# EAGLE design Main_Bord (EAGLE 8.5.1)
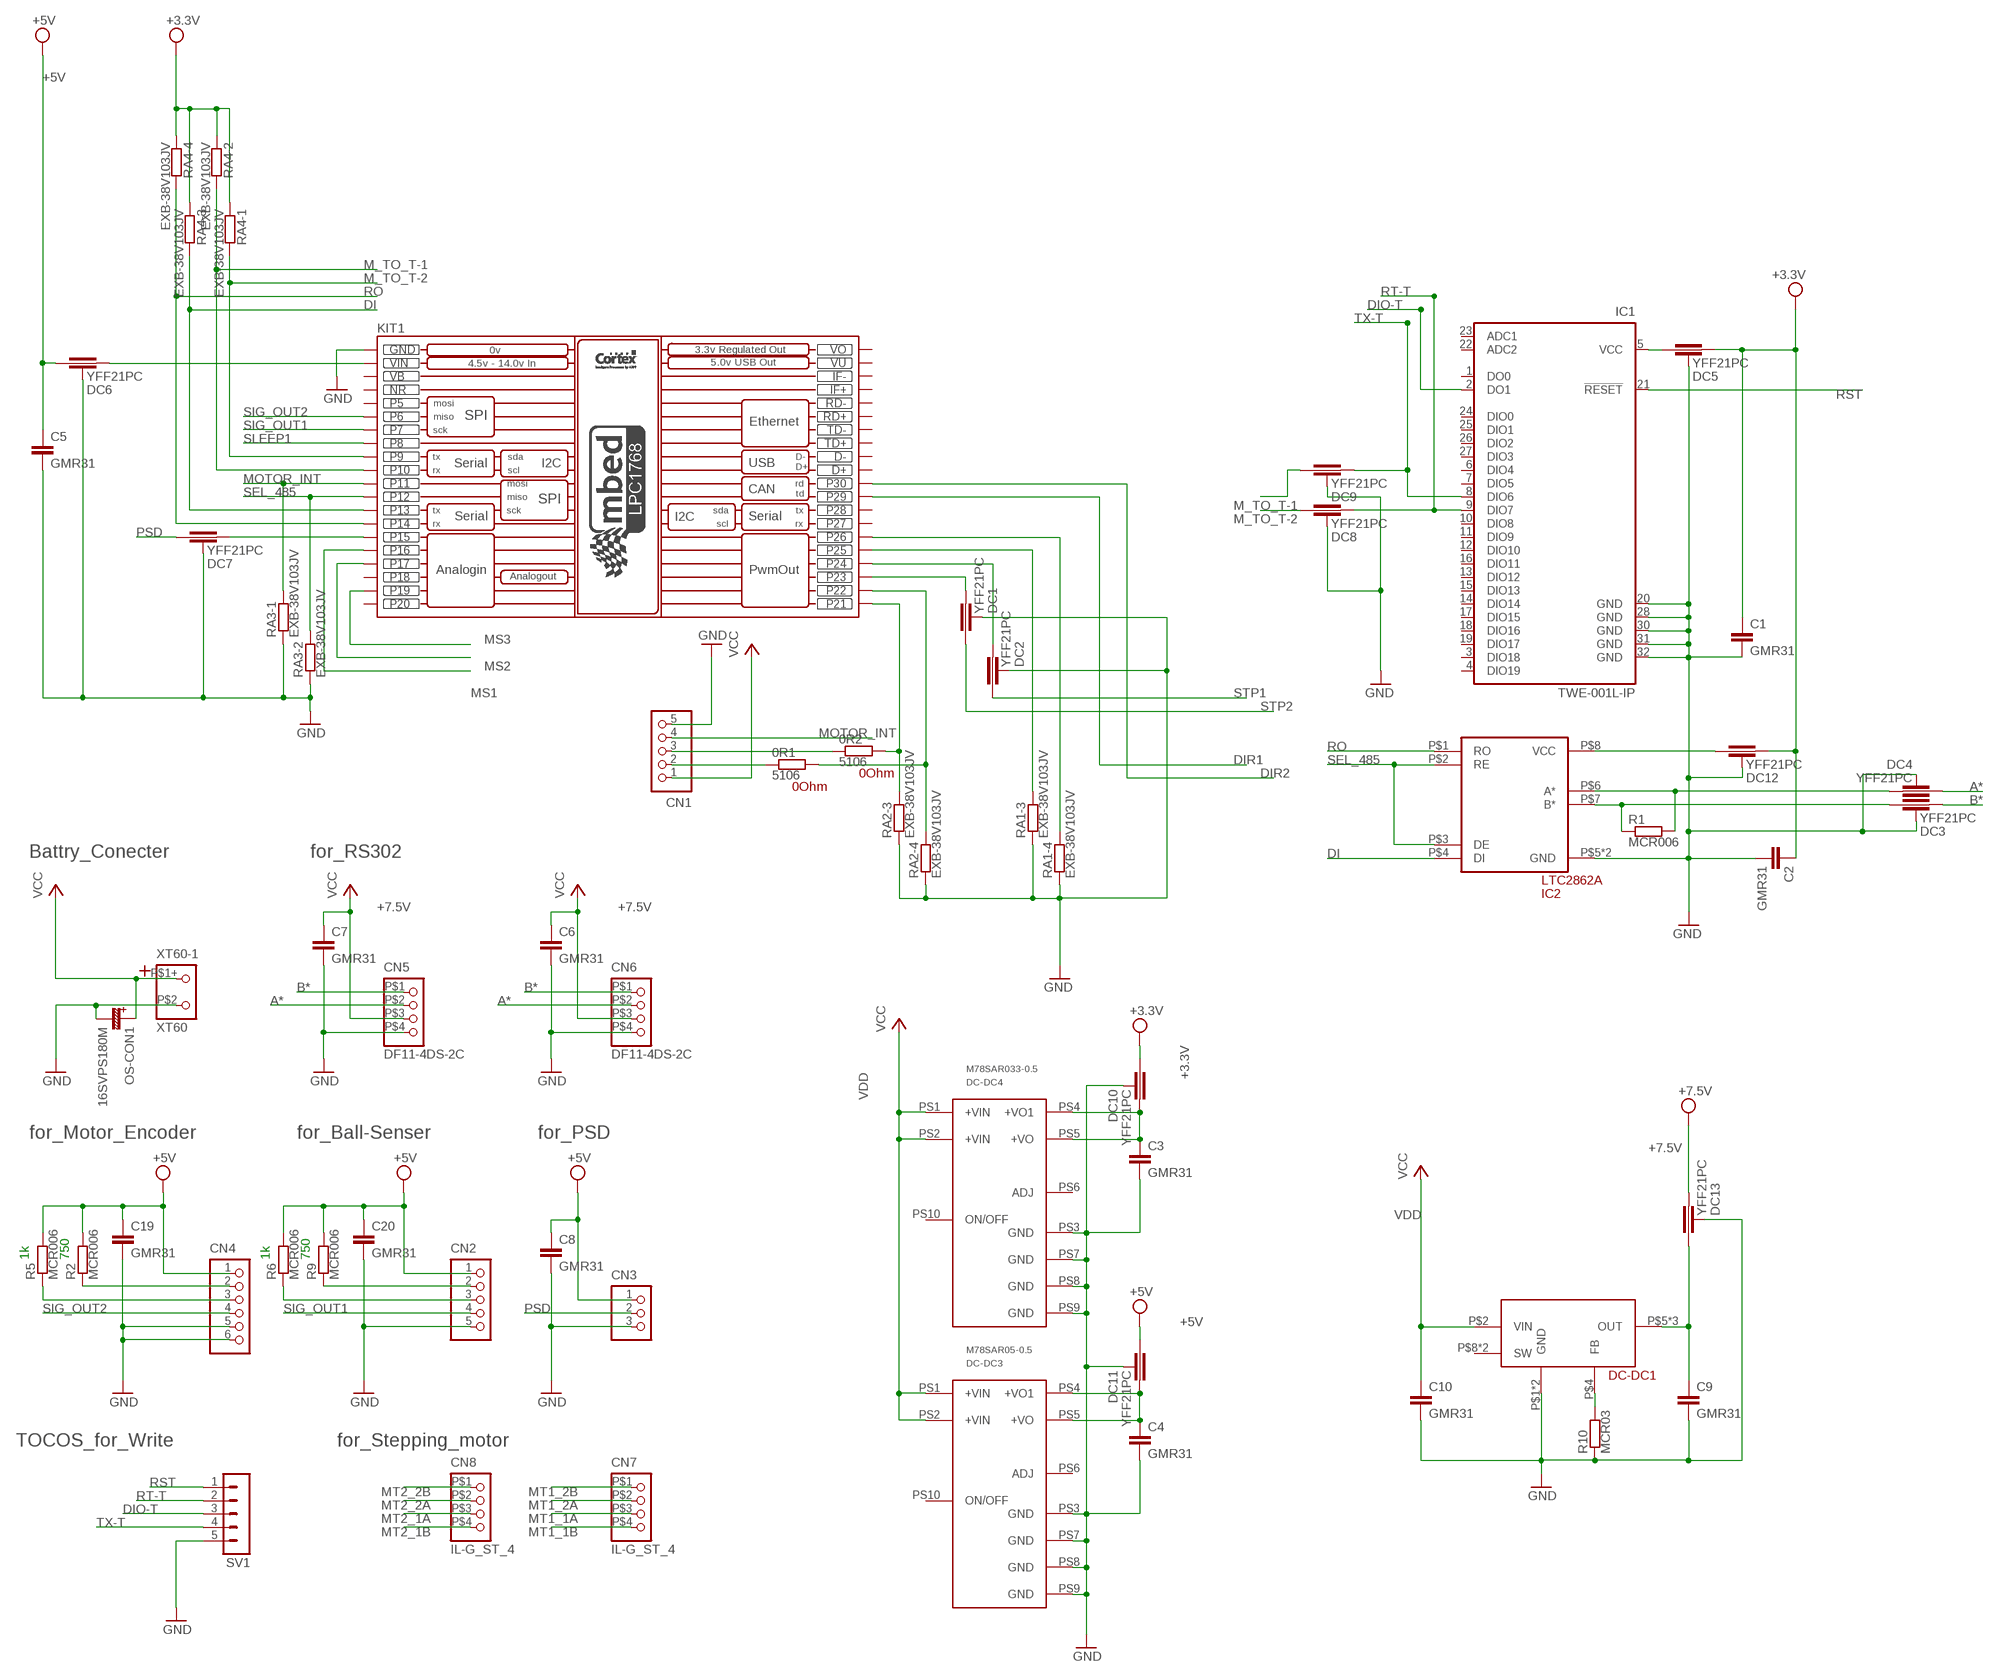
[diagram p0: schematic, sheet 1, part 1 of 2]
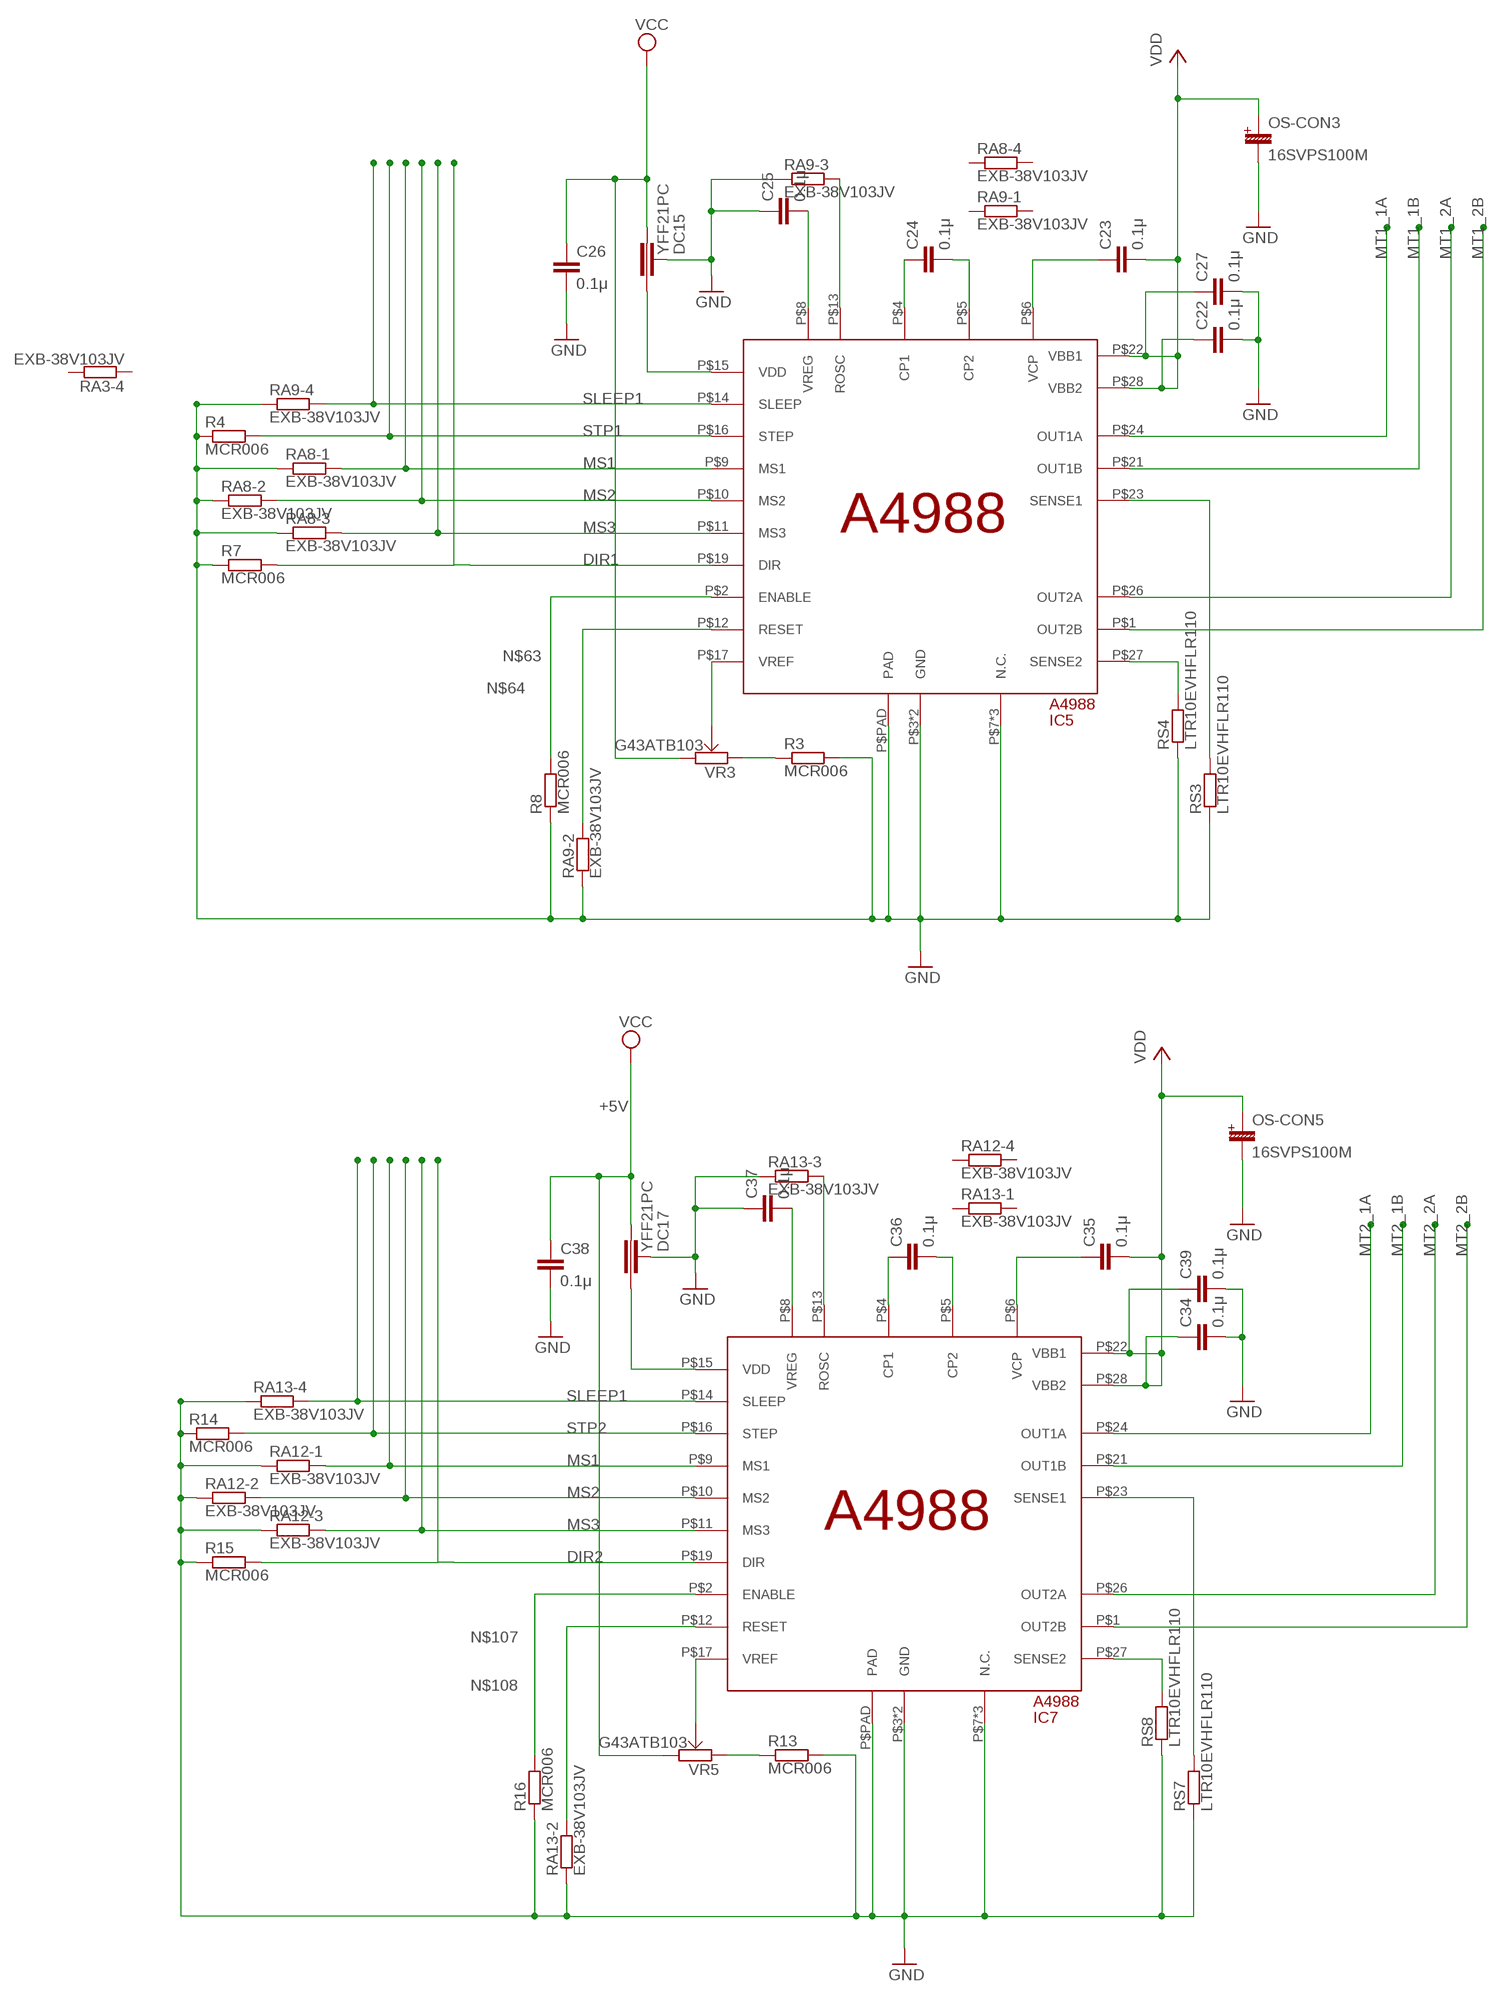
[diagram p1: schematic, sheet 1, part 2 of 2]

## Parts
0R1  5106  [5106JUMP_0805]
0R2  5106  [5106JUMP_0805]
C1  GMR31  [GMR31]
C2  GMR31  [GMR31]
C3  GMR31  [GMR31]
C4  GMR31  [GMR31]
C5  GMR31  [GMR31]
C6  GMR31  [GMR31]
C7  GMR31  [GMR31]
C8  GMR31  [GMR31]
C9  GMR31  [GMR31]
C10  GMR31  [GMR31]
C19  GMR31  [GMR31]
C20  GMR31  [GMR31]
C22  0.1μ  GRM033R61C104KE14  [GRM03]
C23  0.1μ  GRM033R61C104KE14  [GRM03]
C24  0.1μ  GRM033R61C104KE14  [GRM03]
C25  0.1μ  GRM033R61C104KE14  [GRM03]
C26  0.1μ  GRM033R61C104KE14  [GRM03]
C27  0.1μ  GRM033R61C104KE14  [GRM03]
C34  0.1μ  GRM033R61C104KE14  [GRM03]
C35  0.1μ  GRM033R61C104KE14  [GRM03]
C36  0.1μ  GRM033R61C104KE14  [GRM03]
C37  0.1μ  GRM033R61C104KE14  [GRM03]
C38  0.1μ  GRM033R61C104KE14  [GRM03]
C39  0.1μ  GRM033R61C104KE14  [GRM03]
CN1  B5B-XH-A  [B5B-XH-A]
CN2  B5B-XH-A  [B5B-XH-A]
CN3  B3B-XH-A  [B3B-XH-A]
CN4  B6B-XH-A  [B6B-XH-A]
CN5  DF11-4DS-2C  [DF11-4DS-2C]
CN6  DF11-4DS-2C  [DF11-4DS-2C]
CN7  IL-G_ST_4  [IL-G_V-4]
CN8  IL-G_ST_4  [IL-G_V-4]
DC1  YFF21PC  [YFF21PC]
DC2  YFF21PC  [YFF21PC]
DC3  YFF21PC  [YFF21PC]
DC4  YFF21PC  [YFF21PC]
DC5  YFF21PC  [YFF21PC]
DC6  YFF21PC  [YFF21PC]
DC7  YFF21PC  [YFF21PC]
DC8  YFF21PC  [YFF21PC]
DC9  YFF21PC  [YFF21PC]
DC10  YFF21PC  [YFF21PC]
DC11  YFF21PC  [YFF21PC]
DC12  YFF21PC  [YFF21PC]
DC13  YFF21PC  [YFF21PC]
DC15  YFF21PC  [YFF21PC]
DC17  YFF21PC  [YFF21PC]
DC-DC1  MPM01  [MPM00_V]
DC-DC3  M78SAR05-0.5  [M78SAR]
DC-DC4  M78SAR033-0.5  [M78SAR]
IC1  TWE-001L-IP  [QFN32]
IC2  LTC2862A  [DD_PACKGE_8]
IC5  A4988  [ET_PACKGE,28PIN_WITH_EXPAD]
IC7  A4988  [ET_PACKGE,28PIN_WITH_EXPAD]
KIT1  MBED_NXP_LPC1768  [MBED-KIT]
OS-CON1  16SVPS180M  [SVCP_F8]
OS-CON3  16SVPS100M  [SVCP_F8]
OS-CON5  16SVPS100M  [SVCP_F8]
R1  MCR006  [MCR006]
R2  MCR006  [MCR006]
R3  MCR006  [MCR006]
R4  MCR006  [MCR006]
R5  MCR006  [MCR006]
R6  MCR006  [MCR006]
R7  MCR006  [MCR006]
R8  MCR006  [MCR006]
R9  MCR006  [MCR006]
R10  MCR03  [MCR03]
R13  MCR006  [MCR006]
R14  MCR006  [MCR006]
R15  MCR006  [MCR006]
R16  MCR006  [MCR006]
RA1  EXB-38V103JV  [EXB-38V,28V]
RA2  EXB-38V103JV  [EXB-38V,28V]
RA3  EXB-38V103JV  [EXB-38V,28V]
RA4  EXB-38V103JV  [EXB-38V,28V]
RA8  EXB-38V103JV  [EXB-38V,28V]
RA9  EXB-38V103JV  [EXB-38V,28V]
RA12  EXB-38V103JV  [EXB-38V,28V]
RA13  EXB-38V103JV  [EXB-38V,28V]
RS3  LTR10EVHFLR110  [LTR10]
RS4  LTR10EVHFLR110  [LTR10]
RS7  LTR10EVHFLR110  [LTR10]
RS8  LTR10EVHFLR110  [LTR10]
SV1  MA05-1  [MA05-1]
VR3  G43ATB103  [G43A]
VR5  G43ATB103  [G43A]
XT60-1  XT60  [XT60]

## Nets
+3.3V: C1.P$1 C2.P$1 DC5.P$2 DC10.P$1 DC12.P$2 RA4.P$5 RA4.P$6 RA4.P$7 RA4.P$8
+5V: C5.P$1 C8.P$1 C19.P$1 C20.P$1 C26.P$1 C38.P$1 CN2.1 CN3.1 CN4.1 DC6.P$1 DC11.P$1 DC15.P$2 DC17.P$2 R2.P$1 R5.P$1 R6.P$1 R9.P$1 VR3.P$2 VR5.P$2 ; supply symbol labelled VCC
+7.5V: C6.P$1 C7.P$1 CN5.P$3 CN6.P$3 DC13.P$2 ; supply symbol labelled VCC
A*: CN5.P$2 CN6.P$2 DC4.P$1
B*: CN5.P$1 CN6.P$1 DC3.P$2
DI: IC2.P$4(DI) KIT1.P$13(P13) RA4.P$3
DIO-T: IC1.2(DO1) SV1.3
DIR1: IC5.P$19(DIR) KIT1.P$29(P29) R7.P$1
DIR2: IC7.P$19(DIR) KIT1.P$30(P30) R15.P$1
DIR5: IC5.P$23(SENSE1) RS3.P$1
DIR7: IC7.P$23(SENSE1) RS7.P$1
GND: C1.P$2 C2.P$2 C3.P$2 C4.P$2 C5.P$2 C6.P$2 C7.P$2 C8.P$2 C9.P$2 C10.P$2 C19.P$2 C20.P$2 C22.P$2 C25.P$1 C26.P$2 C27.P$2 C34.P$2 C37.P$1 C38.P$2 C39.P$2 CN1.5 CN2.5 CN3.3 CN4.5 CN4.6 CN5.P$4 CN6.P$4 DC1.GND1(GND) DC1.GND2(GND) DC2.GND1(GND) DC2.GND2(GND) DC3.GND1(GND) DC3.GND2(GND) DC4.GND1(GND) DC4.GND2(GND) DC5.GND1(GND) DC5.GND2(GND) DC6.GND1(GND) DC6.GND2(GND) DC7.GND1(GND) DC7.GND2(GND) DC8.GND1(GND) DC8.GND2(GND) DC9.GND1(GND) DC9.GND2(GND) DC10.GND1(GND) DC10.GND2(GND) DC11.GND1(GND) DC11.GND2(GND) DC12.GND1(GND) DC12.GND2(GND) DC13.GND1(GND) DC13.GND2(GND) DC15.GND1(GND) DC15.GND2(GND) DC17.GND1(GND) DC17.GND2(GND) DC-DC1.P$1(GND) DC-DC1.P$3(GND) DC-DC3.PS3(GND) DC-DC3.PS7(GND) DC-DC3.PS8(GND) DC-DC3.PS9(GND) DC-DC4.PS3(GND) DC-DC4.PS7(GND) DC-DC4.PS8(GND) DC-DC4.PS9(GND) IC1.20(GND) IC1.28(GND) IC1.30(GND) IC1.31(GND) IC1.32(GND) IC2.P$5(GND) IC2.PAD(GND) IC5.P$3(GND) IC5.P$7(N.C.) IC5.P$18(GND) IC5.P$20(N.C.) IC5.P$25(N.C.) IC5.P$PAD(PAD) IC7.P$3(GND) IC7.P$7(N.C.) IC7.P$18(GND) IC7.P$20(N.C.) IC7.P$25(N.C.) IC7.P$PAD(PAD) KIT1.GND OS-CON1.P$1 OS-CON3.P$1 OS-CON5.P$1 R3.P$1 R4.P$2 R7.P$2 R8.P$2 R10.P$2 R13.P$1 R14.P$2 R15.P$2 R16.P$2 RA1.P$5 RA1.P$6 RA2.P$5 RA2.P$6 RA3.P$7 RA3.P$8 RA8.P$6 RA8.P$7 RA8.P$8 RA9.P$5 RA9.P$6 RA9.P$7 RA12.P$6 RA12.P$7 RA12.P$8 RA13.P$5 RA13.P$6 RA13.P$7 RS3.P$2 RS4.P$2 RS7.P$2 RS8.P$2 SV1.5 XT60-1.P$2
M_TO_T-1: DC9.P$1 KIT1.P$10(P10) RA4.P$2
M_TO_T-2: DC8.P$1 KIT1.P$9(P9) RA4.P$1
MOTOR_INT: CN1.4 KIT1.P$11(P11) RA3.P$1
MS1: IC5.P$9(MS1) IC7.P$9(MS1) KIT1.P$16(P16) RA8.P$1 RA12.P$1
MS2: IC5.P$10(MS2) IC7.P$10(MS2) KIT1.P$17(P17) RA8.P$2 RA12.P$2
MS3: IC5.P$11(MS3) IC7.P$11(MS3) KIT1.P$19(P19) RA8.P$3 RA12.P$3
MT1_1A: CN7.P$3 IC5.P$24(OUT1A)
MT1_1B: CN7.P$4 IC5.P$21(OUT1B)
MT1_2A: CN7.P$2 IC5.P$26(OUT2A)
MT1_2B: CN7.P$1 IC5.P$1(OUT2B)
MT2_1A: CN8.P$3 IC7.P$24(OUT1A)
MT2_1B: CN8.P$4 IC7.P$21(OUT1B)
MT2_2A: CN8.P$2 IC7.P$26(OUT2A)
MT2_2B: CN8.P$1 IC7.P$1(OUT2B)
N$1: 0R2.P$1 KIT1.P$21(P21) RA2.P$3
N$2: 0R1.P$1 KIT1.P$22(P22) RA2.P$4
N$3: DC6.P$2 KIT1.VIN
N$4: DC5.P$1 IC1.5(VCC)
N$5: DC7.P$2 KIT1.P$15(P15)
N$6: C9.P$1 DC13.P$1 DC-DC1.P$5(OUT) DC-DC1.P$6(OUT) DC-DC1.P$7(OUT)
N$7: KIT1.P$25(P25) RA1.P$3
N$8: KIT1.P$26(P26) RA1.P$4
N$9: DC-DC1.P$4(FB) R10.P$1
N$10: 0R2.P$2 CN1.3
N$11: 0R1.P$2 CN1.2
N$13: C3.P$1 DC10.P$2 DC-DC4.PS4(+VO1) DC-DC4.PS5(+VO)
N$14: DC4.P$2 IC2.P$6(A*) R1.P$1
N$15: DC3.P$1 IC2.P$7(B*) R1.P$2
N$36: DC2.P$2 KIT1.P$24(P24)
N$37: DC1.P$2 KIT1.P$23(P23)
N$38: CN2.2 R9.P$2
N$39: CN2.3 R6.P$2
N$40: CN4.2 R2.P$2
N$41: CN4.3 R5.P$2
N$43: C4.P$1 DC11.P$2 DC-DC3.PS4(+VO1) DC-DC3.PS5(+VO)
N$44: DC12.P$1 IC2.P$8(VCC)
N$57: C23.P$1 IC5.P$6(VCP)
N$58: C24.P$1 IC5.P$4(CP1)
N$59: C24.P$2 IC5.P$5(CP2)
N$60: IC5.P$27(SENSE2) RS4.P$1
N$61: C25.P$2 IC5.P$8(VREG)
N$62: IC5.P$13(ROSC) RA9.P$3
N$63: IC5.P$2(ENABLE) R8.P$1
N$64: IC5.P$12(RESET) RA9.P$2
N$65: R3.P$2 VR3.P$3
N$66: IC5.P$17(VREF) VR3.P$1(IO3)
N$67: DC15.P$1 IC5.P$15(VDD)
N$101: C35.P$1 IC7.P$6(VCP)
N$102: C36.P$1 IC7.P$4(CP1)
N$103: C36.P$2 IC7.P$5(CP2)
N$104: IC7.P$27(SENSE2) RS8.P$1
N$105: C37.P$2 IC7.P$8(VREG)
N$106: IC7.P$13(ROSC) RA13.P$3
N$107: IC7.P$2(ENABLE) R16.P$1
N$108: IC7.P$12(RESET) RA13.P$2
N$109: R13.P$2 VR5.P$3
N$110: IC7.P$17(VREF) VR5.P$1(IO3)
N$111: DC17.P$1 IC7.P$15(VDD)
PSD: CN3.2 DC7.P$1
RO: IC2.P$1(RO) KIT1.P$14(P14) RA4.P$4
RST: IC1.21(!RESET) SV1.1
RT-T: DC8.P$2 IC1.9(DIO7) SV1.2
SEL_485: IC2.P$2(RE) IC2.P$3(DE) KIT1.P$12(P12) RA3.P$2
SIG_OUT1: CN2.4 KIT1.P$7(P7)
SIG_OUT2: CN4.4 KIT1.P$6(P6)
SLEEP1: IC5.P$14(SLEEP) IC7.P$14(SLEEP) KIT1.P$8(P8) RA9.P$4 RA13.P$4
STP1: DC2.P$1 IC5.P$16(STEP) R4.P$1
STP2: DC1.P$1 IC7.P$16(STEP) R14.P$1
TX-T: DC9.P$2 IC1.8(DIO6) SV1.4
VDD: C10.P$1 C22.P$1 C23.P$2 C27.P$1 C34.P$1 C35.P$2 C39.P$1 CN1.1 DC-DC1.P$2(VIN) DC-DC3.PS1(+VIN) DC-DC3.PS2(+VIN) DC-DC4.PS1(+VIN) DC-DC4.PS2(+VIN) IC5.P$22(VBB1) IC5.P$28(VBB2) IC7.P$22(VBB1) IC7.P$28(VBB2) OS-CON1.P$2+(+) OS-CON3.P$2+(+) OS-CON5.P$2+(+) XT60-1.P$1+(1+) ; supply symbol labelled VCC
Unconnected: DC-DC1.P$8(SW) DC-DC1.P$9(SW) DC-DC3.PS6(ADJ) DC-DC3.PS10(ON/OFF) DC-DC4.PS6(ADJ) DC-DC4.PS10(ON/OFF) IC1.1(DO0) IC1.3(DIO18) IC1.4(DIO19) IC1.6(DIO4) IC1.7(DIO5) IC1.10(DIO8) IC1.11(DIO9) IC1.12(DIO10) IC1.13(DIO12) IC1.14(DIO14) IC1.15(DIO13) IC1.16(DIO11) IC1.17(DIO15) IC1.18(DIO16) IC1.19(DIO17) IC1.22(ADC2) IC1.23(ADC1) IC1.24(DIO0) IC1.25(DIO1) IC1.26(DIO2) IC1.27(DIO3) KIT1.D+ KIT1.D- KIT1.IF+ KIT1.IF- KIT1.P$5(P5) KIT1.P$18(P18) KIT1.P$20(P20) KIT1.P$27(P27) KIT1.P$28(P28) KIT1.RD+ KIT1.RD- KIT1.TD+ KIT1.TD- RA1.P$1 RA1.P$2 RA1.P$7 RA1.P$8 RA2.P$1 RA2.P$2 RA2.P$7 RA2.P$8 RA3.P$3 RA3.P$4 RA3.P$5 RA3.P$6 RA8.P$4 RA8.P$5 RA9.P$1 RA9.P$8 RA12.P$4 RA12.P$5 RA13.P$1 RA13.P$8

## Notes on the sheet
- Battry_Conecter | for_RS302
- for_Motor_Encoder | for_Ball-Senser | for_PSD
- 1k | 750 | 1k | 750
- TOCOS_for_Write | for_Stepping_motor

## Power pins joined to a net without a drawn wire
NR: KIT1.NR
VB: KIT1.VB
VO: KIT1.VOUT(VO)
VU: KIT1.VU

## Library data of the parts
0R1 0R2 = Keystone:5106: 0 Ohms ジャンパ 0.5W、1/2W チップ抵抗 0805（2012メートル法） 金属素子
C1-C10 C19 C20 = Murata:GMR31
C22-C27 C34-C39 = Murata:GRM033R61C104KE14
CN1 CN2 = jst-xh:B5B-XH-A: Wire-to-Board 2.5mm pitch top mount connector Source: http://www.jst-mfg.com/product/pdf/jpn/XH.pdf http://www.jst-mfg.com/product/detail.php?series=277
CN3 = jst-xh:B3B-XH-A: Wire-to-Board 2.5mm pitch top mount connector Source: http://www.jst-mfg.com/product/pdf/jpn/XH.pdf http://www.jst-mfg.com/product/detail.php?series=277
CN4 = jst-xh:B6B-XH-A: Wire-to-Board 2.5mm pitch top mount connector Source: http://www.jst-mfg.com/product/pdf/jpn/XH.pdf http://www.jst-mfg.com/product/detail.php?series=277
CN5 CN6 = Hirose:DF11-4DS-2C
CN7 CN8 = IL-G:IL-G_ST_4
DC1-DC13 DC15 DC17 = TDK:YFF21PC
DC-DC1 = SANKEN:MPM01
DC-DC3 DC-DC4 = MINMAX:M78SAR
IC1 = tocos:TWE-001L*: ZigBee 2.4GHz Wireless transceiver module Source: http://tocos-wireless.com/files/datasheet/TWD-PDS-TWE001L-JP-1.30.pdf
IC2 = LT:LTC2862A
IC5 IC7 = Allegro:A4988
KIT1 = MBED_v2.1:MBED_NXP_LPC1768: Mbed LPC1768 - ARM CORTEX v2.1 * Schematic symbol is now placed in eagles's default raster. *The pads diameter are suitable for routing between mbed pins * mbed pads are 0.8 mm drill diameter. --------------------------------------------- Created by: Mohamed Yousry *Alexandria, Egypt *Email: mohamed.yousry@ieeegoldegypt.org
OS-CON1 = OS-CON:16SVPS180M
OS-CON3 OS-CON5 = OS-CON:16SVPS100M
R1-R9 R13-R16 = ROHM:MCR006
R10 = ROHM:MCR03
RA1-RA4 RA8 RA9 RA12 RA13 = Pana_Chip_RA:EXB-38V103JV
RS3 RS4 RS7 RS8 = ROHM:LTR10EVHFLR110
SV1 = con-lstb:MA05-1: PIN HEADER; OC_FARNELL: unknown; OC_NEWARK: unknown
VR3 VR5 = tocos:G43ATB103
XT60-1 = AMASS:XT60

## Board
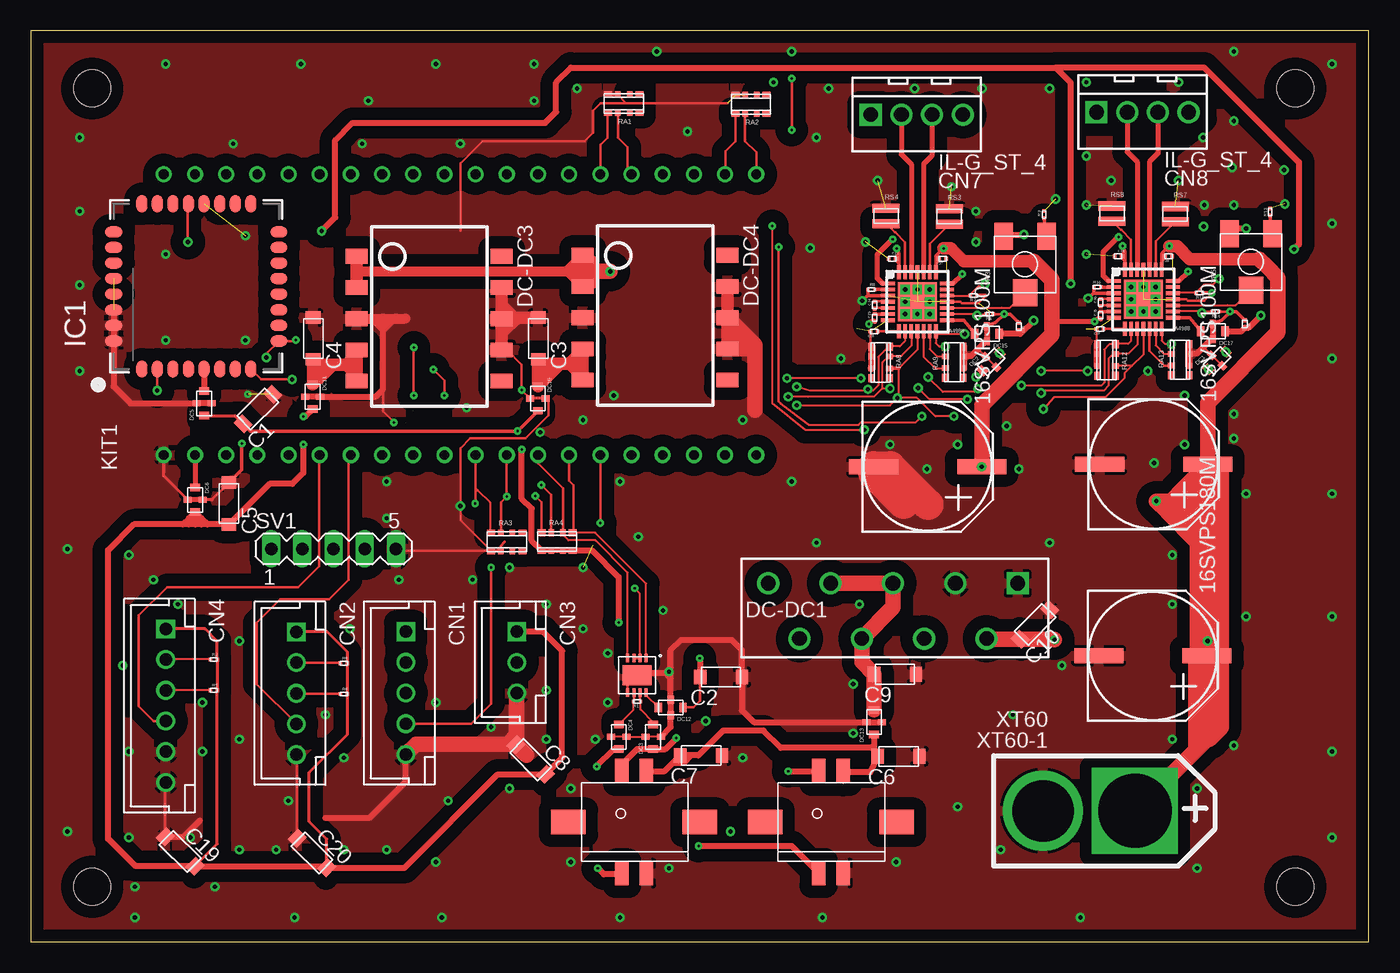
[diagram p2: board, top side]
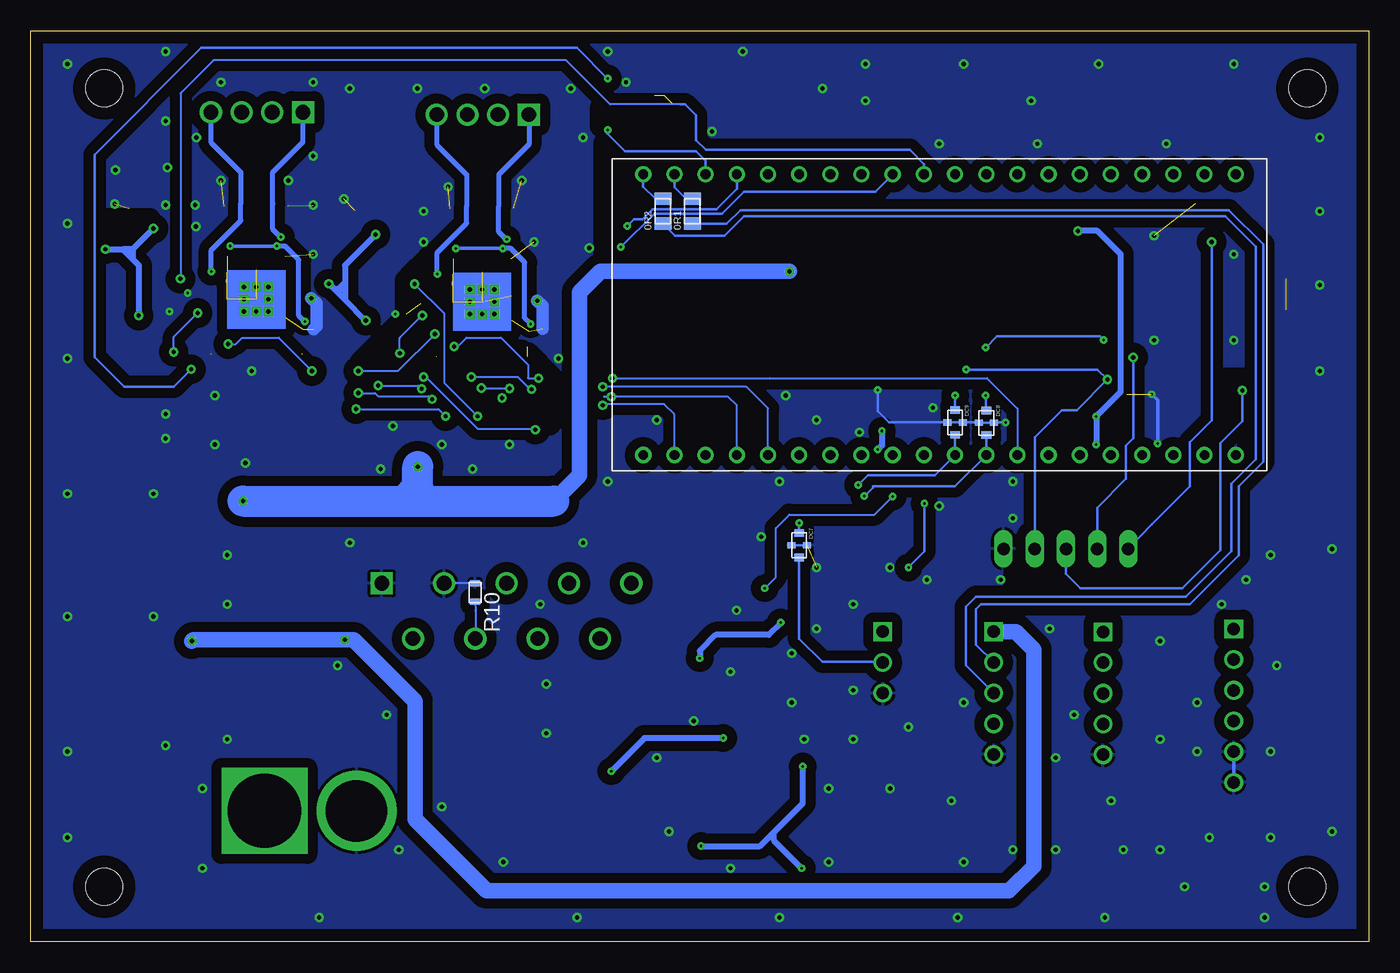
[diagram p3: board, bottom side, seen from below]

Size 109 x 74.2 mm. Coordinates in mm from the lower left corner, seen from the top.
Outline: 0,0 109,0 109,74.2 0,74.2 0,0
Copper layers (1*16): Top 0.035mm / dielectric 1.5mm / Bottom 0.035mm
Design rules "default": minimum track width 6mil, minimum drill 0.35mm, track to track 6mil, track to pad 6mil, pad to pad 6mil, via to via 6mil, smd to smd 6mil, copper to edge 40mil, drill to drill 6mil, minimum pad ring 10mil, minimum via ring 8mil, stop-mask expansion 4mil, vias tented up to drill 0mil, thermal gap 10mil
Holes 3 mm at 5,69.5 5,4.5 103,4.5 103,69.5
tRestrict: 34 lines
bRestrict: 64 lines

### Footprints (pad centres in the part's own frame; a part is rotated, then mirrored left to right if it is on the bottom)
5106JUMP_0805 = smd 1.015 x 1.4: P$1 1.015,0; P$2 -1.015,0
GMR31 = smd 1 x 1.2: P$1 0,0; P$2 3.4,0
GRM03 = smd 0.3 x 0.3: P$1 0,0; P$2 0.6,0
B5B-XH-A = drill 1.016 square: 1 -5,0 | drill 1.016: 2 -2.5,0; 3 0,0; 4 2.5,0; 5 5,0
B3B-XH-A = drill 1.016 square: 1 -2.5,0 | drill 1.016: 2 0,0; 3 2.5,0
B6B-XH-A = drill 1.016 square: 1 -6.25,0 | drill 1.016: 2 -3.75,0; 3 -1.25,0; 4 1.25,0; 5 3.75,0; 6 6.25,0
DF11-4DS-2C = smd 1.1 x 2: P$1 1,-4.15; P$2 1,4.15; P$3 -1,-4.15; P$4 -1,4.15 | smd 2.8 x 2: TAB -5.35,0; TAB2 5.35,0
IL-G_V-4 = drill 1.2 square: P$1 0,0 | drill 1.2: P$2 2.5,0; P$3 5,0; P$4 7.5,0
YFF21PC = smd 0.5 x 0.65: GND1 0,0.625; GND2 0,-0.625 | smd 0.6 x 0.8: P$1 -1,0; P$2 1,0
MPM00_V = drill 1.2 pad 1.778 square: P$1 0,0 | drill 1.2 pad 1.778: P$2 2.54,4.5; P$3 5.08,0; P$4 7.62,4.5; P$5 10.16,0; P$6 12.7,4.5; P$7 15.24,0; P$8 17.78,4.5; P$9 20.32,0
M78SAR = smd 1.2 x 1.8: PS1 0,-11.8; PS2 2.54,-11.8; PS3 5.08,-11.8; PS4 7.62,-11.8; PS5 10.16,-11.8; PS6 10.16,0; PS7 7.62,0; PS8 5.08,0; PS9 2.54,0; PS10 0,0
QFN32 = smd 1.4 x 0.9: 1 -6.735,4.445; 2 -6.735,3.175; 3 -6.735,1.905; 4 -6.735,0.635; 5 -6.735,-0.635; 6 -6.735,-1.905; 7 -6.735,-3.175; 8 -6.735,-4.445; 17 6.735,-4.445; 18 6.735,-3.175; 19 6.735,-1.905; 20 6.735,-0.635; 21 6.735,0.635; 22 6.735,1.905; 23 6.735,3.175; 24 6.735,4.445 | smd 0.9 x 1.4: 9 -4.445,-6.735; 10 -3.175,-6.735; 11 -1.905,-6.735; 12 -0.635,-6.735; 13 0.635,-6.735; 14 1.905,-6.735; 15 3.175,-6.735; 16 4.445,-6.735; 25 4.445,6.735; 26 3.175,6.735; 27 1.905,6.735; 28 0.635,6.735; 29 -0.635,6.735; 30 -1.905,6.735; 31 -3.175,6.735; 32 -4.445,6.735
DD_PACKGE_8 = smd 0.25 x 0.7: P$1 -0.75,-1.4; P$2 -0.25,-1.4; P$3 0.25,-1.4; P$4 0.75,-1.4; P$5 0.75,1.4; P$6 0.25,1.4; P$7 -0.25,1.4; P$8 -0.75,1.4 | smd 2.38 x 1.65: PAD 0,0
ET_PACKGE,28PIN_WITH_EXPAD = smd 1.15 x 0.3: P$1 -2.4,1.5; P$2 -2.4,1; P$3 -2.4,0.5; P$4 -2.4,0; P$5 -2.4,-0.5; P$6 -2.4,-1; P$7 -2.4,-1.5; P$15 2.4,-1.5; P$16 2.4,-1; P$17 2.4,-0.5; P$18 2.4,0; P$19 2.4,0.5; P$20 2.4,1; P$21 2.4,1.5 | smd 0.3 x 1.15: P$8 -1.5,-2.4; P$9 -1,-2.4; P$10 -0.5,-2.4; P$11 0,-2.4; P$12 0.5,-2.4; P$13 1,-2.4; P$14 1.5,-2.4; P$22 1.5,2.4; P$23 1,2.4; P$24 0.5,2.4; P$25 0,2.4; P$26 -0.5,2.4; P$27 -1,2.4; P$28 -1.5,2.4 | smd 3.15 x 3.15: P$PAD 0,0
MBED-KIT = drill 0.8: D+ 11.43,1.27; D- 11.43,3.81; GND -11.43,24.13; IF+ 11.43,16.51; IF- 11.43,19.05; NR -11.43,16.51; P$5 -11.43,13.97; P$6 -11.43,11.43; P$7 -11.43,8.89; P$8 -11.43,6.35; P$9 -11.43,3.81; P$10 -11.43,1.27; P$11 -11.43,-1.27; P$12 -11.43,-3.81; P$13 -11.43,-6.35; P$14 -11.43,-8.89; P$15 -11.43,-11.43; P$16 -11.43,-13.97; P$17 -11.43,-16.51; P$18 -11.43,-19.05; P$19 -11.43,-21.59; P$20 -11.43,-24.13; P$21 11.43,-24.13; P$22 11.43,-21.59; P$23 11.43,-19.05; P$24 11.43,-16.51; P$25 11.43,-13.97; P$26 11.43,-11.43; P$27 11.43,-8.89; P$28 11.43,-6.35; P$29 11.43,-3.81; P$30 11.43,-1.27; RD+ 11.43,11.43; RD- 11.43,13.97; TD+ 11.43,6.35; TD- 11.43,8.89; VB -11.43,19.05; VIN -11.43,21.59; VOUT 11.43,24.13; VU 11.43,21.59
SVCP_F8 = smd 1.2 x 4: P$1 0,4.4; P$2+ 0,-4.4
MCR006 = smd 0.27 x 0.3: P$1 0,0; P$2 0.57,0
MCR03 = smd 0.5 x 0.8: P$1 0,0; P$2 1.5,0
EXB-38V,28V = smd 0.65 x 0.55: P$1 -1.275,0.725; P$4 1.275,0.725; P$5 1.275,-0.725; P$8 -1.275,-0.725 | smd 0.45 x 0.55: P$2 -0.475,0.725; P$3 0.475,0.725; P$6 0.475,-0.725; P$7 -0.475,-0.725
LTR10 = smd 0.74 x 2.2: P$1 0,0; P$2 1.24,0
MA05-1 = drill 1.016 long: 1 -5.08,0; 2 -2.54,0; 3 0,0; 4 2.54,0; 5 5.08,0
G43A = smd 2 x 2.2: P$1 0,2.3 | smd 1.5 x 2.2: P$2 1.75,-2.3; P$3 -1.75,-2.3
XT60 = drill 6 square: P$1+ 0,0 | drill 5 pad 6.5: P$2 7.5,0

### Placement (x,y rotation side)
0R1  55.1,59.5 90 bottom
0R2  57.5,59.5 90 bottom
C1  17.3,42.19 45 top
C2  54.54,21.58 0 top
C3  41.34,47.44 90 top
C4  23.02,47.44 90 top
C5  16.16,34 90 top
C6  69,15.11 0 top
C7  52.92,15.19 0 top
C8  41.93,13.64 135 top
C9  68.7,21.8 0 top
C10  80.62,24.66 45 top
C19  13.38,6.16 135 top
C20  24.12,6.04 135 top
C22  70.48,55.63 180 top
C23  68.75,51.13 270 top
C24  68.75,52.16 270 top
C25  68.4,49.71 0 top
C26  80.5,49.82 90 top
C27  73.98,55.63 0 top
C34  88.88,55.83 180 top
C35  87.15,51.33 270 top
C36  87.15,52.36 270 top
C37  86.8,49.91 0 top
C38  98.9,50.02 90 top
C39  92.38,55.83 0 top
CN1  30.55,20.27 270 top
CN2  21.65,20.25 270 top
CN3  39.59,22.76 270 top
CN4  11,19.24 270 top
CN5  65.18,9.76 180 top
CN6  49.16,9.75 180 top
CN7  68.42,67.37 0 top
CN8  86.82,67.57 0 top
DC1  96.64,47.34 225 top
DC2  78.23,47.23 225 top
DC3  50.7,16.7 270 top
DC4  47.9,16.7 90 top
DC5  14.13,43.86 270 top
DC6  13.4,36 90 top
DC7  46.4,32.3 90 bottom
DC8  31.15,42.27 90 bottom
DC9  33.7,42.3 90 bottom
DC10  41.31,44.25 90 top
DC11  22.97,44.4 90 top
DC12  52.13,19.1 0 top
DC13  68.7,17.9 270 top
DC15  77.9,49.52 0 top
DC17  96.3,49.72 0 top
DC-DC1  80.4,29.2 180 top
DC-DC3  38.36,55.83 270 top
DC-DC4  56.76,55.91 270 top
IC1  13.49,53.38 90 top
IC2  49.38,21.71 180 top
IC5  72.23,52.13 0 top
IC7  90.63,52.33 0 top
KIT1  34.97,51.08 90 top
OS-CON1  91.4,23.3 90 top
OS-CON3  73.07,38.7 90 top
OS-CON5  91.47,38.9 90 top
R1  49.1,19.58 0 top
R2  15.2,23 180 top
R3  82.56,59.53 270 top
R4  77.82,51.14 0 top
R5  15.2,20.5 180 top
R6  25.8,20.2 180 top
R7  76.53,52.65 0 top
R8  68.77,53.13 180 top
R9  25.8,22.7 180 top
R10  72.8,27.7 90 bottom
R13  100.96,59.73 270 top
R14  96.22,51.34 0 top
R15  94.93,52.85 0 top
R16  87.17,53.33 180 top
RA1  48.31,68.27 180 top
RA2  58.68,68.21 180 top
RA3  38.77,32.58 0 top
RA4  42.88,32.6 0 top
RA8  69.23,47.19 270 top
RA9  75.23,47.21 90 top
RA12  87.63,47.39 270 top
RA13  93.63,47.41 90 top
RS3  74.82,58.45 90 top
RS4  69.68,58.49 90 top
RS7  93.22,58.65 90 top
RS8  88.08,58.69 90 top
SV1  24.67,32.01 0 top
VR3  80.99,55.18 180 top
VR5  99.39,55.38 180 top
XT60-1  89.96,10.67 180 top

### Tracks (layer width: path | path; a pad name or v marks a point on that pad's centre or on a via)
+3.3V  (via drill 0.2)
  Top 0.2: C2.P$1 54.54,21.5 54.54,19.64 53.99,19.09 DC12.P$2
  Top 0.254: DC5.P$2 16.63,42.86 C1.P$1
  Top 0.305: DC10.P$1 v39.66,41.6 17.89,41.6 C1.P$1
  Top 0.508: v40,40.1 40,36.1 40.8,35.3 40.8,32.69 RA4.P$8 RA4.P$7 RA4.P$6 RA4.P$5 45.72,31.88 47.9,29.7 v47.9,26 | v54.5,23.1 54.5,21.54 54.54,21.5
  Bottom 0.508: v39.66,41.6 39.66,40.44 v40,40.1 | v47.9,26 48.9,25 53.2,25 54.5,23.7 v54.5,23.1
+5V  (via drill 0.2, 0.35)
  Top 0.203: 98.89,50.01 C38.P$1 | C26.P$1 80.24,49.56 80.2,49.52 DC15.P$2
  Top 0.254: CN4.1 14.21,25.49 15.2,24.5 R2.P$1 R5.P$1 15.2,7.99 C19.P$1 | CN2.1 24.05,25.25 24.1,25.3 25.8,23.6 R9.P$1 R6.P$1 25.8,16.9 22.7,13.8 22.7,9.8 24.12,8.38 C20.P$1
  Top 0.406: DC6.P$1
  Top 0.508: DC11.P$1 22.38,42.8 v22.2,42.8 | v22.2,40.5 22.2,38.2 21.3,37.3 19.45,37.3 C5.P$1 14.4,34 | 14.4,34 13.9,34 | 13.9,34 13.4,34 | 13.4,34 12.9,34 | 12.9,34 12.4,34 | 12.4,34 8.4,34 6.3,31.9 6.3,8.4 8.54,6.16 C19.P$1 24,6.16 C20.P$1 30.44,6.04 38.04,13.64 C8.P$1 43.3,15 43.3,23.7 41.7,25.3 41.66,25.26 CN3.1 | DC6.P$1 13.4,34.5 | 13.4,34.5 13.4,34 | 13.4,34.5 13.9,34 | 13.4,34.5 12.9,34 | v23.7,57.9 24.8,59 24.8,65.3 26.2,66.7 41.9,66.7 42.8,67.6 42.8,70 44,71.2 83.5,71.2 | v102.9,56.4 103.3,56.8 103.3,63.5 95.6,71.2 83.5,71.2 | 83.5,71.2 84.7,70 v84.7,53.6 | v81.7,50.6 80.66,49.56 | 80.66,49.56 80.24,49.56 | 80.66,49.56 80.62,49.52 DC15.P$2 | DC17.P$2 98.6,49.72 98.89,50.01 | C38.P$1 99.22,50.02 v100.2,51 | VR5.P$2 98.06,58.1 v99,58.1 | VR3.P$2 79.36,57.6 v80.9,57.6 | DC6.P$1 13.9,34.5 | 13.9,34.5 13.9,34 | DC6.P$1 12.9,34.5 | 12.9,34.5 12.9,34 | 13.9,34.5 14.4,34 | 12.9,34.5 12.4,34
  Bottom 0.508: v22.2,40.5 v22.2,42.8 20.2,44.8 20.2,56 22.1,57.9 v23.7,57.9 | v84.7,53.6 84.25,53.15 | 84.25,53.15 83.4,52.3 | 83.4,52.3 v81.7,50.6 | v102.9,56.4 101.5,56.4 | 101.5,56.4 100.7,55.6 | 100.7,55.6 100.2,55.1 v100.2,51 | v99,58.1 100.7,56.4 | 100.7,56.4 101.5,56.4 | 100.7,56.4 100.7,55.6 | v80.9,57.6 83.4,55.1 83.4,53.7 | 83.4,53.7 83.4,53.4 | 83.4,53.4 83.4,52.3 | 83.4,53.4 83.65,53.15 83.95,53.15 | 83.4,53.7 83.95,53.15 | 83.95,53.15 84.25,53.15
+7.5V
  Top 0.254: CN5.P$3 66.18,13.8 66.18,12.98
  Top 0.508: DC13.P$2 68.7,16 | 68.7,16 68.7,14.51 C6.P$1 68.38,13.8 66.18,13.8 | 68.7,16 68.5,15.8 61.1,15.8 59.7,17.2 56.4,17.2 54.38,15.19 53.8,15.19 | 53.8,15.19 C7.P$1 52.31,14.59 | CN6.P$3 51.63,13.9 52.31,14.59 | 52.31,14.59 53.2,14.59 53.8,15.19
A*  (via drill 0.2)
  Top 0.508: CN5.P$2 62,7.8 v54.4,7.8 | CN6.P$2 48.05,5.5 46.7,5.5 v46.2,6 | v46.1,14.3 47.5,15.7 DC4.P$1
  Bottom 0.508: v54.4,7.8 49.6,7.8 48.45,8.95 | v46.2,6 48.45,8.25 48.45,8.95 | v46.1,14.3 46.1,11.3 48.45,8.95
B*  (via drill 0.2)
  Top 0.203: CN5.P$1 64.16,13.94 64.16,14.04 63.88,13.76
  Top 0.508: CN6.P$1 48.16,14.46 49.4,15.7 DC3.P$2 51.7,15.7 v52.6,16.6 | v61.7,13.9 64.17,13.9 CN5.P$1
  Bottom 0.508: v52.6,16.6 59,16.6 v61.7,13.9
DI
  Top 0.127: 43.36,33.14 RA4.P$3
  Top 0.152: IC2.P$4 48.63,30.07 46,32.7 43.8,32.7 43.36,33.14 43.36,33.5
  Top 0.2: RA4.P$3 43.36,33.5 43.36,36.94 41.32,38.98 KIT1.P$13
DIO-T  (via drill 0.35)
  Top 0.2: IC1.2 10.32,44.92 v10.3,44.9
  Bottom 0.2: v10.3,44.9 10.3,42.4 12.1,40.6 12.1,31.9 15.2,28.8 23.5,28.8 24.67,29.97 SV1.3
DIR1  (via drill 0.2, 0.35)
  Top 0.152: IC5.P$19 76.51,52.63 R7.P$1 76.53,52.73 77.2,53.4 77.56,53.4 v77.73,53.57 | v72.6,42.8 72.11,42.31 67.65,42.31 67.44,42.1 63.4,42.1 61.06,43.88
  Top 0.2: v60.93,56.6 60.93,44.01 61.06,43.88
  Bottom 0.152: KIT1.P$29 38.91,62.51 | v72.6,42.8 75.3,45.5 75.3,51.14 v77.73,53.57
  Bottom 0.2: KIT1.P$29 40.19,61.1 50.9,61.1 52.7,59.3 58.2,59.3 60.9,56.6 v60.93,56.6
DIR2  (via drill 0.35)
  Top 0.152: v96.8,54 96.3,53.5 95.55,53.5 95.14,53.09 95.14,53.05 R15.P$1 93.05,52.85 IC7.P$19
  Bottom 0.152: KIT1.P$30 36.31,62.51 | 56.1,68.2 61.8,68.2 65.4,71.8 94.1,71.8 96.8,69.1 v96.8,54
  Bottom 0.2: KIT1.P$30 36.24,63.34 37.4,64.5 54,64.5 54.8,65.3 54.8,67.3 55.7,68.2 56.1,68.2
DIR5
  Top 0.2: IC5.P$23 73.23,56.86 RS3.P$1
DIR7
  Top 0.2: IC7.P$23 91.63,57.06 RS7.P$1
GND  (via drill 0.2, 0.2 pad 0.55, 0.35)  (33 unrouted)
  Top 0.152: 74.62,55.63 C27.P$2 | 93.02,55.83 C39.P$2 | DC1.GND1 DC1.GND2 95.73,48.25 95.35,48.25 | DC2.GND1 DC2.GND2 77.41,48.05 76.95,48.05 | DC4.GND1 DC4.GND2 DC3.GND2 DC3.GND1 51.33,16.77 | C37.P$1 86.8,48.77 RA12.P$8 | 68.4,48.57 RA8.P$8
  Top 0.2: v79.31,51.12 78.41,51.12 R4.P$2 | v97.71,51.32 96.81,51.32 R14.P$2 | RA3.P$8 37.9,31.86 | 37.9,31.86 RA3.P$7 38.3,32.26 | RA1.P$5 RA1.P$6 47.83,68.97 48.5,68.3 | 48.5,68.3 56.77,68.3 | C25.P$1 68.4,48.57 | v29.6,42.3 28.7,43.2 28.7,45.6 | IC2.P$5 48.63,20.96 IC2.PAD | 38.6,32.58 38.3,32.27 38.3,32.26 | 38.3,32.26 37.9,31.86 | RA3.P$8 29.9,31.86 SV1.5 | 48.5,68.3 46.4,68.3 45.8,67.7 45.8,65.9 45.1,65.2 36.8,65.2 35,63.4 35,57.9 | DC10.GND1 v40,44.94 40,47 38.79,48.21 DC-DC3.PS7 | RA3.P$8 35,34.36 v35,35.5 35,40.2 35.8,41 40.3,41 42.2,42.9 42.2,43.99 DC10.GND2
  Top 0.203: IC5.P$18 75.72,52.13 75.84,52.01 77.19,52.01 77.81,52.63 | IC7.P$18 94.12,52.33 94.24,52.21 95.59,52.21 v96.21,52.83 | DC12.GND2
  Top 0.254: C19.P$2 10.97,12.96 CN4.6 | C20.P$2 21.71,15.18 CN2.5 | DC10.GND2 DC10.GND1 | 30.35,50.75 30.5,50.75 | DC6.GND1 10.82,37.96 10.82,38.3 | C5.P$2 14.76,36 DC6.GND2
  Top 0.305: DC15.GND1 78.64,50.44 v79.31,51.12 79.8,51.12 C26.P$2 | R7.P$2 77.78,52.65 77.81,52.63 | IC5.P$3 68.15,52.63 v67.74,52.22 68.2,52.68 R8.P$2 | 75.03,52.13 IC5.P$18 | DC17.GND1 97.04,50.64 v97.71,51.32 98.2,51.32 C38.P$2 | R15.P$2 96.18,52.85 v96.21,52.83 | IC7.P$3 86.55,52.83 v86.14,52.42 86.6,52.88 R16.P$2 | 93.43,52.33 IC7.P$18 | 10.82,38.3 10.82,39.62 KIT1.GND | 86.86,47.85 86.91,47.9 | C5.P$2 17.2,38.45 v17.2,40.6
  Top 0.406: DC6.GND2 DC6.GND1
  Top 0.508: DC15.GND1 DC15.GND2 77.9,49.01 76.95,48.05 76.59,47.7 76.02,47.7 75.96,47.64 | DC17.GND1 DC17.GND2 96.3,49.21 95.35,48.25 94.99,47.9 94.42,47.9 94.36,47.84 | DC5.GND1 DC5.GND2 8.14,43.86 6.76,45.24 IC1.32 IC1.31 IC1.30 | DC11.GND1 DC11.GND2 28.1,44.4 28.7,45 28.7,45.6 28.7,49.8 | 19.9,44.4 C1.P$2 | 28.7,49.8 29.65,50.75 29.75,50.75 | 28.7,49.8 28.7,50.75 | 28.7,49.8 27.75,50.75 27.7,50.75 | DC13.GND1 69.17,17.9 69.13,17.86 68.27,17.86 68.23,17.9 DC13.GND2 58.9,17.9 57.94,18.86 C2.P$2 57.94,23.76 57.1,24.6 53,24.6 52.13,23.73 52.13,22.33 | C19.P$2 12.47,8.57 13.8,9.9 | 24,10.1 27.6,10.1 30.6,13.1 30.55,13.15 CN1.5 | 38.6,16.1 38.6,16.11 39.59,17.1 39.59,16.1 C8.P$2 39.56,16.04 40.4,15.2 | 52.13,21.47 DC12.GND1 DC12.GND2 52.13,17.51 DC3.GND1 | 52.13,21.47 52.13,21.9 | 52.13,21.9 52.13,22.33 | IC2.PAD 49.57,21.9 51.7,21.9 | 51.7,21.9 52.13,21.9 | 51.7,21.9 52.13,22.33 | 51.7,21.9 52.13,21.47 | 39.59,17.4 38.3,16.1 37.8,16.1
  Top 0.61: RA9.P$7 75.96,47.64 RA9.P$5 | RA8.P$8 RA8.P$6 68.49,46.71 | RA13.P$7 94.36,47.84 RA13.P$5 | RA12.P$8 86.91,47.9 RA12.P$6 86.89,46.91
  Top 0.813: DC-DC3.PS3 27.7,50.75 28.7,50.75 29.75,50.75 30.5,50.75 | 38.27,50.75 38.37,50.84
  Top 1.016: 26.56,50.84 DC-DC3.PS3 | 41.35,50.83 C3.P$2 39.6,50.84 | 39.42,50.84 38.37,50.84 DC-DC3.PS8 | DC-DC4.PS7 DC-DC4.PS8 DC-DC4.PS9 | DC-DC3.PS9 38.36,51.9 | 38.36,51.9 DC-DC3.PS8 | DC-DC3.PS8 38.36,49.7 | 38.36,49.7 DC-DC3.PS7 | 38.36,49.7 38.46,49.7 39.6,50.84 | 39.6,50.84 39.42,50.84 | 39.42,50.84 38.36,51.9 | DC-DC4.PS3 44.95,50.84
  Top 1.27: 59,43.3 59,48.59 | 59,48.59 57.99,49.59 | 57.99,49.59 DC-DC4.PS8 | 59,48.59 58.7,48.29 DC-DC4.PS7 56.76,48.36 57.99,49.59 | CN1.5 31.39,16.1 37.8,16.1 38.6,16.1 39.59,16.1 | 39.59,16.1 C8.P$2 40.37,15.2 40.4,15.2 | 39.59,16.1 39.59,17.4 CN3.3
  Top 2.54: 71.1,35.7 68.67,38.13 OS-CON3.P$1 70,38.7 73.1,35.6
  Bottom 0.152: R10.P$2 DC-DC1.P$3
  Bottom 0.2: v29.6,42.3 30.5,42.3 DC8.GND2 DC8.GND1 31.81,42.3 DC9.GND2 DC9.GND1 39.1,42.3 40,43.2 v40,44.94 | DC7.GND1 DC7.GND2
  Bottom 0.305: CN4.6 CN4.5 | v17.2,40.6 17.2,44.1 v17.7,44.6
  Bottom 1.016: 67.32,49.92 67.32,51.79 v67.74,52.22 | 85.95,49.88 85.72,50.12 85.72,51.99 v86.14,52.42
  other vias: 95.6,60 95.55,58.25 97.85,63.05 102.1,62.85 102.15,60.1 17,24.5 26,25.5 17,16.5 21,11.5 20,7.5 17,7.5 79,7.5 106,8.5 106,15.5 106,26.5 106,36.5 106,47.5 106,58.5 106,71.5 80,18.5 93,16.5 84,22.5 83,32.5 93,31.5 93,27.5 48,37.5 62,37.5 64,32.5 39,30.5 42,27.5 45,25.5 45,30.5 29,37.5 29,34.5 36,29.5 30,29.5 33,19.5 42,20.5 42,16.5 29,7.5 34,11.5 39,12.5 33,6.5 44,6.5 44,12.5 46,16.5 47,19.5 47,23.5 13,8.5 8,8.5 14,19.5 14,15.5 10,29.5 8,31.5 8,15.5 12,27.5 4,59.5 4,53.5 4,46.5 41,71.5 33,71.5 22,71.5 11,71.5 4,65.5 98,72.5 62,72.5 77,57 77,59.5 75,61.5 83.5,60.5 83,69.5 77.5,69.5 63.5,56.5 69,62 64,65.5 65,69.5 72,69.5 66,47.5 68,57 86,56 86,60 88,62 98,66.85 98,60 93.5,62 95.5,65.5 86,70 93.5,70 86,64 94,40.5 91.5,39 94,44.5 91,46.5 79.5,42 80.5,38.5 75.5,40.5 73,38.5 70,40.5 99,36.5 99,26.5 98,41 98,43 98,16 95,12.5 95,6 8.5,4.5 15,4.5 21.5,2 8.5,2 33.5,2 48,2 64.5,2 85.5,2 52,22 55,18 67,17 67,21 67.5,27.5 51.5,27 49.5,33 37.5,17.5 25.5,7.5 25.5,15 7.5,22.5 41.5,41.5 45,42.5 47.5,44.5 58,42.5 35.5,43.5 41,68.5 27.5,68.5 16.5,65 27,65 35,65 44.5,69.5 53.5,66 60.5,70 3,32 3,9 11,49 11,56 17.5,49 17.5,57.5 51,72.5 24,18.5 52,6 70.5,6.5 75.5,11 58,15 57,9
  pour Top (isolate 1.016): -1.4,75.4 110.5,75.4 110.5,-1.6 -1.4,-1.6
  pour Bottom (isolate 0.813): -1.8,75.9 111,75.9 111,61.5 111,-2.4 107.3,-2.4 -2.4,-2.4 -2.4,75.9
M_TO_T-1  (via drill 0.2)
  Top 0.2: RA4.P$2 42.41,36.39 v41.6,37.2
  Bottom 0.152: KIT1.P$10 33.75,39.65
  Bottom 0.2: DC9.P$1 KIT1.P$10 35.35,38 40.8,38 v41.6,37.2
M_TO_T-2  (via drill 0.2)
  Top 0.2: RA4.P$1 41.61,35.79 v41.1,36.3
  Bottom 0.2: DC8.P$1 KIT1.P$9 33.71,37.1 40.4,37.1 40.4,37 v41.1,36.3
MOTOR_INT  (via drill 0.2)
  Top 0.152: 36.4,36.8 37.4,35.8 37.4,33.31 RA3.P$1
  Top 0.2: CN1.4 35.87,17.77 37.5,19.4 v37.5,30.5 | KIT1.P$11 36.24,37 36.24,36.96 | 36.24,36.96 36.24,35.74 v36.2,35.7 | 36.4,36.8 36.24,36.96
  Bottom 0.2: v37.5,30.5 36.2,31.8 v36.2,35.7
MS1  (via drill 0.35)
  Top 0.152: IC5.P$9 71.23,48.93 70.8,48.5 69.99,48.5 RA8.P$1 69.86,48.46 69.04,47.64 69.04,45.34 68.6,44.9 68.2,44.9 | IC7.P$9 89.63,48.93 89.4,48.7 88.39,48.7 RA12.P$1 87.86,48.66 87.82,48.62 87.44,48.24 87.44,45.54 87.2,45.3 v80.7,45.3 | v77.15,45.05 76.9,44.8 74.3,44.8 v73.1,46 | 68.2,44.9 63.49,44.9 v62.39,45.2 | 68.2,44.9 v68.2,45.01
  Bottom 0.152: v80.7,45.3 77.4,45.3 v77.15,45.05 | v68.2,45.01 68.31,45.01 69.3,46 v73.1,46 | v62.39,45.2 50.7,45.2 48.94,43.44 KIT1.P$16
MS2  (via drill 0.35)
  Top 0.152: 69.4,45.1 68.7,44.4 63.36,44.4 63.35,44.39 v61.71,44.39 | IC5.P$10 71.73,48.53 70.9,47.7 69.99,47.7 RA8.P$2 69.86,47.66 69.4,47.2 69.4,45.1 | IC7.P$10 90.13,48.63 89.4,47.9 88.39,47.9 RA12.P$2 88.16,47.86 87.8,47.5 87.8,45.3 87.4,44.9 82.51,44.9 v82.3,44.69 | v76.31,44.19 73.21,44.19 v72.3,45.1 | v70,45.06 69.44,45.06 69.4,45.1
  Bottom 0.152: v82.3,44.69 80.95,44.69 80.7,44.44 76.55,44.44 v76.31,44.19 | v72.3,45.1 70.04,45.1 v70,45.06 | KIT1.P$17 51.48,43.68 52.2,44.4 62.3,44.4 v61.71,44.39
MS3  (via drill 0.35)
  Top 0.152: v62.4,43.7 70,43.7 v70.6,44.3 | v70.6,44.3 70.71,44.41 70.71,46.71 72.23,48.24 IC5.P$11 | IC7.P$11 90.63,47.83 89.7,46.9 | 89.7,46.9 RA12.P$3 | 89.7,46.9 89.1,46.3 89.1,45.9 87.55,44.35 | 87.55,44.35 87.5,44.3 | 87.55,44.35 83.36,44.35 v82.5,43.39 | v75.2,42.8 73.7,42.8 72.2,44.3 v70.6,44.3
  Top 0.305: 70.71,46.71 RA8.P$3 | 72.24,49.72 IC5.P$11
  Bottom 0.152: v82.5,43.39 75.79,43.39 v75.2,42.8 | KIT1.P$19 56.56,42.96 57.4,43.8 62.04,43.8 62.05,43.79 62.56,43.79 62.57,43.8 v62.4,43.7
MT1_1A
  Top 0.406: IC5.P$24 72.73,63.33 73.42,64.02 CN7.P$3
MT1_1B  (via drill 0.2)
  Top 0.406: IC5.P$21 75.12,53.63 v75.88,54.39
  Bottom 0.406: v75.88,54.39 75.88,56.13 73.48,58.53 73.48,59.93 | 73.48,59.93 73.49,59.94 | 73.48,59.93 73.48,62.48 75.92,64.92 CN7.P$4
MT1_2A
  Top 0.406: IC5.P$26 71.73,63.33 70.92,64.14 CN7.P$2
MT1_2B  (via drill 0.2)
  Top 0.305: IC5.P$1 69.38,53.63
  Top 0.406: 69.38,53.63 68.97,54.04 68.97,55.99 v70.2,57.22
  Bottom 0.305: 70.2,57.24 v70.2,57.22
  Bottom 0.406: v70.2,57.22 70.26,57.22 70.88,57.84 70.88,59.91 | 70.88,59.91 70.87,59.92 | 70.88,59.91 70.88,62.48 68.42,64.94 CN7.P$1
MT2_1A
  Top 0.406: IC7.P$24 91.13,63.53 91.82,64.22 CN8.P$3
MT2_1B  (via drill 0.2)
  Top 0.406: IC7.P$21 93.52,53.83 v94.28,54.59
  Bottom 0.406: v94.28,54.59 94.28,56.33 91.88,58.73 91.88,60.13 | 91.88,60.13 91.89,60.14 | 91.88,60.13 91.88,62.68 94.32,65.12 CN8.P$4
MT2_2A
  Top 0.406: IC7.P$26 90.13,63.53 89.32,64.34 CN8.P$2
MT2_2B  (via drill 0.2)
  Top 0.305: IC7.P$1 87.78,53.83
  Top 0.406: 87.78,53.83 87.37,54.24 87.37,56.19 v88.6,57.42
  Bottom 0.305: 88.6,57.44 v88.6,57.42
  Bottom 0.406: v88.6,57.42 88.66,57.42 89.28,58.04 89.28,60.11 | 89.28,60.11 89.27,60.12 | 89.28,60.11 89.28,62.68 88.43,63.53 88.43,63.54 86.83,65.14 CN8.P$1
N$1
  Top 0.2: KIT1.P$21 59.1,64.3 58.2,65.2 RA2.P$3
  Bottom 0.2: KIT1.P$21 59.1,62.3 59.1,62.22 59.1,61.5 58.12,60.52 0R2.P$1
N$2
  Top 0.2: RA2.P$4 57.4,65.2 56.6,64.4 56.6,62.55 KIT1.P$22
  Bottom 0.2: 0R1.P$1 55.62,60.52 56.56,61.46 KIT1.P$22
N$3
  Top 0.406: KIT1.VIN 13.38,37.02 DC6.P$2
N$4
  Top 0.508: IC1.5 DC5.P$1
N$5  (via drill 0.2)
  Top 0.2: KIT1.P$15 v46.4,34.1
  Bottom 0.2: v46.4,34.1 DC7.P$2
N$6
  Top 1.27: DC-DC1.P$7 DC-DC1.P$5 70.24,27.24 DC-DC1.P$6 67.7,22.8 C9.P$1 DC13.P$1
N$7
  Top 0.2: RA1.P$3 47.83,65.47 48.6,64.7 48.6,62.85 KIT1.P$25
N$8
  Top 0.2: KIT1.P$26 46.4,64.9 47,65.5 47,67.51 RA1.P$4
N$9
  Bottom 0.152: R10.P$1 72.78,26.98 DC-DC1.P$4
N$10
  Bottom 0.2: CN1.3 32.8,22.52 32.8,27.3 32,28.1 14.9,28.1 11.2,31.8 11.2,37.3 9.2,39.3 9.2,56.6 11.7,59.1 50.9,59.1 52.5,57.5 56.52,57.5 0R2.P$2
N$11
  Bottom 0.2: CN1.2 32,24.22 32,27.1 31.6,27.5 14.6,27.5 10.6,31.5 10.6,37.1 8.6,39.1 8.6,56.8 11.4,59.6 51.2,59.6 52.31,58.48 0R1.P$2
N$13
  Top 1.016: 44.96,47.1 DC-DC4.PS4 44.96,48.16 43.9,47.1 | 44.96,47.1 DC-DC4.PS5 44.96,46.04 43.9,47.1 | 41.31,46.6 DC10.P$2 43.16,47.1 | 41.31,46.6 41.31,47.41 C3.P$1 | 43.16,47.1 43.9,47.1 | 43.9,47.1 44.96,47.1 | 43.16,47.1 41.81,47.1 41.31,46.6
N$14
  Top 0.152: DC4.P$2 49.1,18.9 R1.P$1
  Top 0.203: IC2.P$6 49.13,19.61 R1.P$1
N$15
  Top 0.152: R1.P$2 49.67,18.93 50.7,17.9 DC3.P$1
  Top 0.203: IC2.P$7 49.63,19.62 R1.P$2
N$36  (via drill 0.2, 0.35)
  Top 0.152: DC2.P$2 v77,46 | v60.4,58.3 60.4,43.9 63.1,41.7 v67.9,41.7
  Bottom 0.152: v77,46 76.8,46 72.6,41.8 68,41.8 v67.9,41.7
  Bottom 0.2: v60.4,58.3 59.85,58.85 59.15,58.85 58.35,59.65 53.15,59.65 51.48,61.32 KIT1.P$24
N$37  (via drill 0.2, 0.35)
  Top 0.2: v62,66.1 v62,70.3
  Bottom 0.2: DC1.P$2 97.37,45.2 101.4,45.2 103.8,47.6 103.8,64.1 95.1,72.8 64.5,72.8 v62,70.3 | KIT1.P$23 54.02,63.62 54.8,64.4 60.6,64.4 62,65.8 v62,66.1
  other vias: 95.93,46.63
N$38
  Top 0.203: CN2.2 25.18,22.75 R9.P$2
N$39
  Top 0.203: R6.P$2 21.7,20.2 CN2.3
N$40
  Top 0.152: R2.P$2 11.01,23 CN4.2
N$41
  Top 0.152: R5.P$2 11.01,20.5 CN4.3
N$43
  Top 1.016: 26.56,47 DC-DC3.PS4 26.56,47.86 25.7,47 | 26.56,47 DC-DC3.PS5 26.56,46.14 25.7,47 | DC11.P$2 23.02,45.44 | 23.02,45.44 23.02,46.8 | 23.02,46.8 C4.P$1 | 23.02,45.44 24.57,47 | 24.57,47 25.7,47 | 25.7,47 26.56,47 | 24.57,47 23.22,47 23.02,46.8
N$44
  Top 0.203: IC2.P$8 50.13,20.1 DC12.P$1
N$57
  Top 0.305: C23.P$1 IC5.P$6
N$58
  Top 0.2: C24.P$1 69.8,52.16 IC5.P$4
N$59
  Top 0.2: IC5.P$5 68.82,51.63 C24.P$2
N$60
  Top 0.2: RS4.P$1 70.4,57.77 70.43,57.77 71.23,56.97 IC5.P$27
N$61
  Top 0.2: IC5.P$8 69.02,49.73 C25.P$2
N$62
  Top 0.152: IC5.P$13 73.23,48.27 73.8,47.7 74.49,47.7 RA9.P$3
N$63
  Top 0.305: IC5.P$2 R8.P$1
N$64
  Top 0.152: IC5.P$12 72.73,47.67 73.7,46.7 74.47,46.7 RA9.P$2
N$65
  Top 0.305: VR3.P$3 82.57,58.75 R3.P$2
N$66
  Top 0.152: IC5.P$17 79.07,51.63 79.09,51.65 79.76,51.65 VR3.P$1
N$67
  Top 0.305: IC5.P$15 76.01,50.63 DC15.P$1
N$68  (via drill 0.35)
  other vias: 71.23,52.13
N$69  (via drill 0.35)
  other vias: 73.23,52.13
N$70  (via drill 0.35)
  other vias: 72.23,53.13
N$71  (via drill 0.35)
  other vias: 72.23,51.13
N$72  (via drill 0.35)
  other vias: 71.23,51.13
N$73  (via drill 0.35)
  other vias: 73.23,51.13
N$74  (via drill 0.35)
  Bottom 0.813: v73.23,53.13 73.84,53.13 74.32,53.61
N$75  (via drill 0.35)
  other vias: 71.23,53.13
N$101
  Top 0.305: C35.P$1 IC7.P$6
N$102
  Top 0.2: C36.P$1 88.2,52.36 IC7.P$4
N$103
  Top 0.2: IC7.P$5 87.22,51.83 C36.P$2
N$104
  Top 0.2: RS8.P$1 88.8,57.97 88.83,57.97 89.63,57.17 IC7.P$27
N$105
  Top 0.2: IC7.P$8 87.42,49.93 C37.P$2
N$106
  Top 0.152: IC7.P$13 91.63,48.57 92.3,47.9 92.89,47.9 RA13.P$3
N$107
  Top 0.305: IC7.P$2 R16.P$1
N$108
  Top 0.2: RA13.P$2 92.34,46.93 91.13,48.14 IC7.P$12
N$109
  Top 0.305: VR5.P$3 100.97,58.95 R13.P$2
N$110
  Top 0.152: IC7.P$17 97.47,51.83 97.49,51.85 98.16,51.85 VR5.P$1
N$111
  Top 0.305: IC7.P$15 94.41,50.83 DC17.P$1
N$112  (via drill 0.35)
  other vias: 89.63,52.33
N$113  (via drill 0.35)
  other vias: 91.63,52.33
N$114  (via drill 0.35)
  other vias: 90.63,53.33
N$115  (via drill 0.35)
  other vias: 90.63,51.33
N$116  (via drill 0.35)
  other vias: 89.63,51.33
N$117  (via drill 0.35)
  other vias: 91.63,51.33
N$118  (via drill 0.35)
  Bottom 0.813: v91.63,53.33 92.24,53.33 92.72,53.81
N$119  (via drill 0.35)
  other vias: 89.63,53.33
PSD
  Bottom 0.2: DC7.P$1 46.4,24.7 44.5,22.8 39.63,22.8 CN3.2
RO
  Top 0.152: IC2.P$1 50.13,29.17 45.97,33.33 RA4.P$4
  Top 0.2: KIT1.P$14 43.86,37.54 44.2,37.2 44.2,33.8 44.2,33.37 RA4.P$4
RST  (via drill 0.35)
  Top 0.2: IC1.21 12.8,60.06 v12.8,57
  Bottom 0.2: v12.8,57 12.8,42.5 14.6,40.7 14.6,37.1 17.69,34.01 SV1.1
RT-T  (via drill 0.2, 0.35)  (1 unrouted)
  Top 0.2: v19.2,47.6 19.2,47.91 IC1.9 21.53,48.93 v21.6,49 | v31.2,48.4 v31.2,44.5
  Bottom 0.2: v19.2,47.6 19.2,41 19.8,40.4 19.8,37.7 22.13,35.37 SV1.2 | v21.6,49 21.9,49.3 30.3,49.3 v31.2,48.4 | v31.2,44.5 31.2,43.32 DC8.P$2
SEL_485  (via drill 0.2)
  Top 0.152: IC2.P$3 IC2.P$2 49.63,28.37 v49.2,28.8
  Top 0.2: KIT1.P$12 v38.78,36.28 38.3,35.8 RA3.P$2
  Bottom 0.152: v49.2,28.8 48.3,29.7 48.3,33.7 47.2,34.8 40.26,34.8 v38.78,36.28
SIG_OUT1
  Top 0.2: CN2.4 18.4,21 18.4,26 20.3,27.9 24.3,27.9 25.9,29.5 25.9,39.47 KIT1.P$7
SIG_OUT2
  Top 0.2: CN4.4 10.01,17.99 8.8,19.2 8.8,26.6 11.1,28.9 21.3,28.9 21.8,28.9 23.5,30.6 23.5,39.61 KIT1.P$6
SLEEP1  (via drill 0.35)
  Top 0.152: RA9.P$4 74.49,48.5 74,48.5 73.73,48.77 73.73,49.42 73.81,49.5 v76.07,49.5 | IC7.P$14 92.13,48.97 92.4,48.7 92.89,48.7 RA13.P$4 | v67.63,45.9 v61.6,45.9 | v86.1,46.5 v82.3,46.5
  Top 0.305: 73.73,49.42 IC5.P$14 | 92.13,49.62 IC7.P$14
  Bottom 0.15: KIT1.P$8 28.62,43.42 31.1,45.9 48.8,45.9
  Bottom 0.152: RA9.P$4 74.22,48.48 73.5,49.2 70.7,49.2 68.5,47 68.5,45.9 v67.63,45.9 | v61.6,45.9 48.8,45.9 | RA13.P$4 92.29,48.68 91.78,49.19 88.81,49.19 88.8,49.2 v86.1,46.5 | v82.3,46.5 79.07,46.5 v76.07,49.5
  other vias: 74.51,48.48 92.91,48.68
STP1  (via drill 0.35)
  Top 0.152: 77.1,51.13 IC5.P$16 | 77.1,51.13 77.81,51.13 R4.P$1 | v77.1,51.02 77.1,51.13
  Bottom 0.152: DC2.P$1 78.94,49.18 v77.1,51.02
  other vias: 78.94,47.94
STP2  (via drill 0.35)
  Top 0.152: 95.4,51.34 R14.P$1 | 95.4,51.34 93.04,51.34 IC7.P$16 | v95.4,51.22 95.4,51.34
  Bottom 0.152: DC1.P$1 97.35,49.27 v95.4,51.22
  other vias: 97.35,48.05
TX-T  (via drill 0.2, 0.35)
  Top 0.2: IC1.8 18.78,45.8 v21.3,45.8 | v33.7,44.5 33.7,45.7 v32.8,46.6
  Bottom 0.2: SV1.4 27.21,41.09 25,43.3 23.8,43.3 v21.3,45.8 22.1,46.6 v32.8,46.6 | DC9.P$2 v33.7,44.5
VDD  (via drill 0.2, 0.35)
  Top 0.305: 73.8,55.91 73.73,55.85 73.73,55.63 | v74.35,56.47 73.8,55.91 | 73.73,55.27 73.73,55.63 | 73.73,55.27 IC5.P$22 | 73.73,55.63 C27.P$1 | C27.P$1 73.98,55.73 73.8,55.91 | C27.P$1 73.98,55.52 73.73,55.27 | v70.55,56.47 70.74,56.02 70.73,56.01 | 70.73,55.27 70.73,55.55 | 70.73,55.27 IC5.P$28 | 70.73,55.55 70.73,56.01 | C22.P$1 70.65,55.63 70.73,55.55 | C22.P$1 70.48,55.52 70.73,55.27 | C22.P$1 70.48,55.76 70.73,56.01 | 92.2,56.11 92.13,56.05 92.13,55.83 | v92.75,56.67 92.2,56.11 | 92.13,55.83 92.13,55.47 | 92.13,55.47 IC7.P$22 | 92.13,55.83 C39.P$1 | C39.P$1 92.38,55.93 92.2,56.11 | C39.P$1 92.38,55.72 92.13,55.47 | v88.95,56.67 89.14,56.22 89.13,56.21 | 89.13,55.47 89.13,55.75 | 89.13,55.47 IC7.P$28 | 89.13,55.75 89.13,56.21 | C34.P$1 89.05,55.83 89.13,55.75 | C34.P$1 88.88,55.72 89.13,55.47 | C34.P$1 88.88,55.96 89.13,56.21
  Top 0.406: C23.P$2 68.49,50.53 v68.28,50.32 | C35.P$2 86.89,50.73 v86.68,50.52 83.3,50.52 83.18,50.4
  Top 0.813: 26.56,54.6 43.65,54.6 | 43.73,54.6 44.2,54.6 44.96,54.6 | 43.73,54.6 DC-DC4.PS2 DC-DC4.PS1 43.65,54.6 | 43.73,54.6 43.65,54.6
  Top 1.016: 81.67,55.41 76.04,55.41 75.01,56.44 74.94,56.44 74.91,56.47 v74.35,56.47 | 100.07,55.61 94.44,55.61 93.41,56.64 93.34,56.64 93.31,56.67 v92.75,56.67 | DC-DC3.PS1 26.56,54.6 DC-DC3.PS2
  Top 1.27: OS-CON3.P$2+ 77.47,43.72 83.18,49.43 83.18,50.4 83.18,53.9 82.32,54.77 82.31,54.77 81.67,55.41 | OS-CON5.P$2+ 95.87,43.92 101.58,49.63 101.58,54.1 100.72,54.97 100.07,55.61 | OS-CON5.P$2+ | OS-CON1.P$2+ 95.87,23.37 v95.87,24.5 95.87,31.73 | 95.87,31.73 95.87,33.5 | 95.87,33.5 95.87,35.5 | 95.87,35.5 95.87,36.5 | 95.87,36.5 95.87,37.5 | 95.87,37.5 OS-CON5.P$2+ | 95.87,31.73 95.05,32.55 | 95.05,32.55 92.55,35.05 | 92.55,35.05 v91.7,35.9 94.27,35.9 | XT60-1.P$1+ 94.89,15.61 | 94.89,15.61 95.8,16.52 | 95.8,16.52 OS-CON1.P$2+ | DC-DC1.P$2 77.9,24.66 C10.P$1 83.34,24.66 v83.4,24.6 | v47.2,54.6 44.2,54.6 | DC-DC4.PS1 45.7,55.17 45.7,53.8 | 94.27,35.9 95.47,35.9 95.87,35.5 | 92.55,35.05 94.32,35.05 94.44,34.94 | 94.44,34.94 95.87,33.5 | 94.44,34.94 95.31,34.94 95.87,35.5 | 94.27,35.9 95.87,37.5 | OS-CON5.P$2+ 94.27,37.3 | 94.27,37.3 94.27,35.9 | 94.27,37.3 92.55,35.58 92.55,35.05 | 95.87,36.5 97,37.63 | 97,37.63 97,38.5 | 95.05,32.55 95.05,23.55 94.89,23.39 94.89,15.61 | OS-CON1.P$2+ 97,24.5 | 97,24.5 97,37.63 | 97,24.5 97,17.5 96.02,16.52 95.8,16.52
  Bottom 0.305: v74.35,56.47 v70.55,56.47 70.51,56.47 | v92.75,56.67 v88.95,56.67 88.91,56.67
  Bottom 0.406: 70.44,56.47 v70.55,56.47 69.89,56.47 68.76,55.34 68.76,50.8 v68.28,50.32 | 88.84,56.67 v88.95,56.67 88.29,56.67 87.16,55.54 87.16,51 v86.68,50.52
  Bottom 1.27: OS-CON3.P$2+ 77.47,38.23 | v95.87,24.5 95.77,24.6 v83.4,24.6 82.7,24.6 77.7,19.6 77.7,10 71.85,4.15 29.3,4.15 27.3,6.15 27.3,23.8 28.77,25.27 CN1.1 | 66.4,35.9 64.3,38 64.3,52.9 62.6,54.6 v47.2,54.6
  Bottom 2.54: v91.7,35.9 78.6,35.9 | OS-CON3.P$2+ 77.47,37.03 78.6,35.9 | 78.6,35.9 66.4,35.9
  other vias: 77.47,38.7
(copper drawn outside any net)
  shapes: Bottom area x2